# Altium schematic sheet USBc to Ethernet(2.0).SchDoc (part 3 of 3)
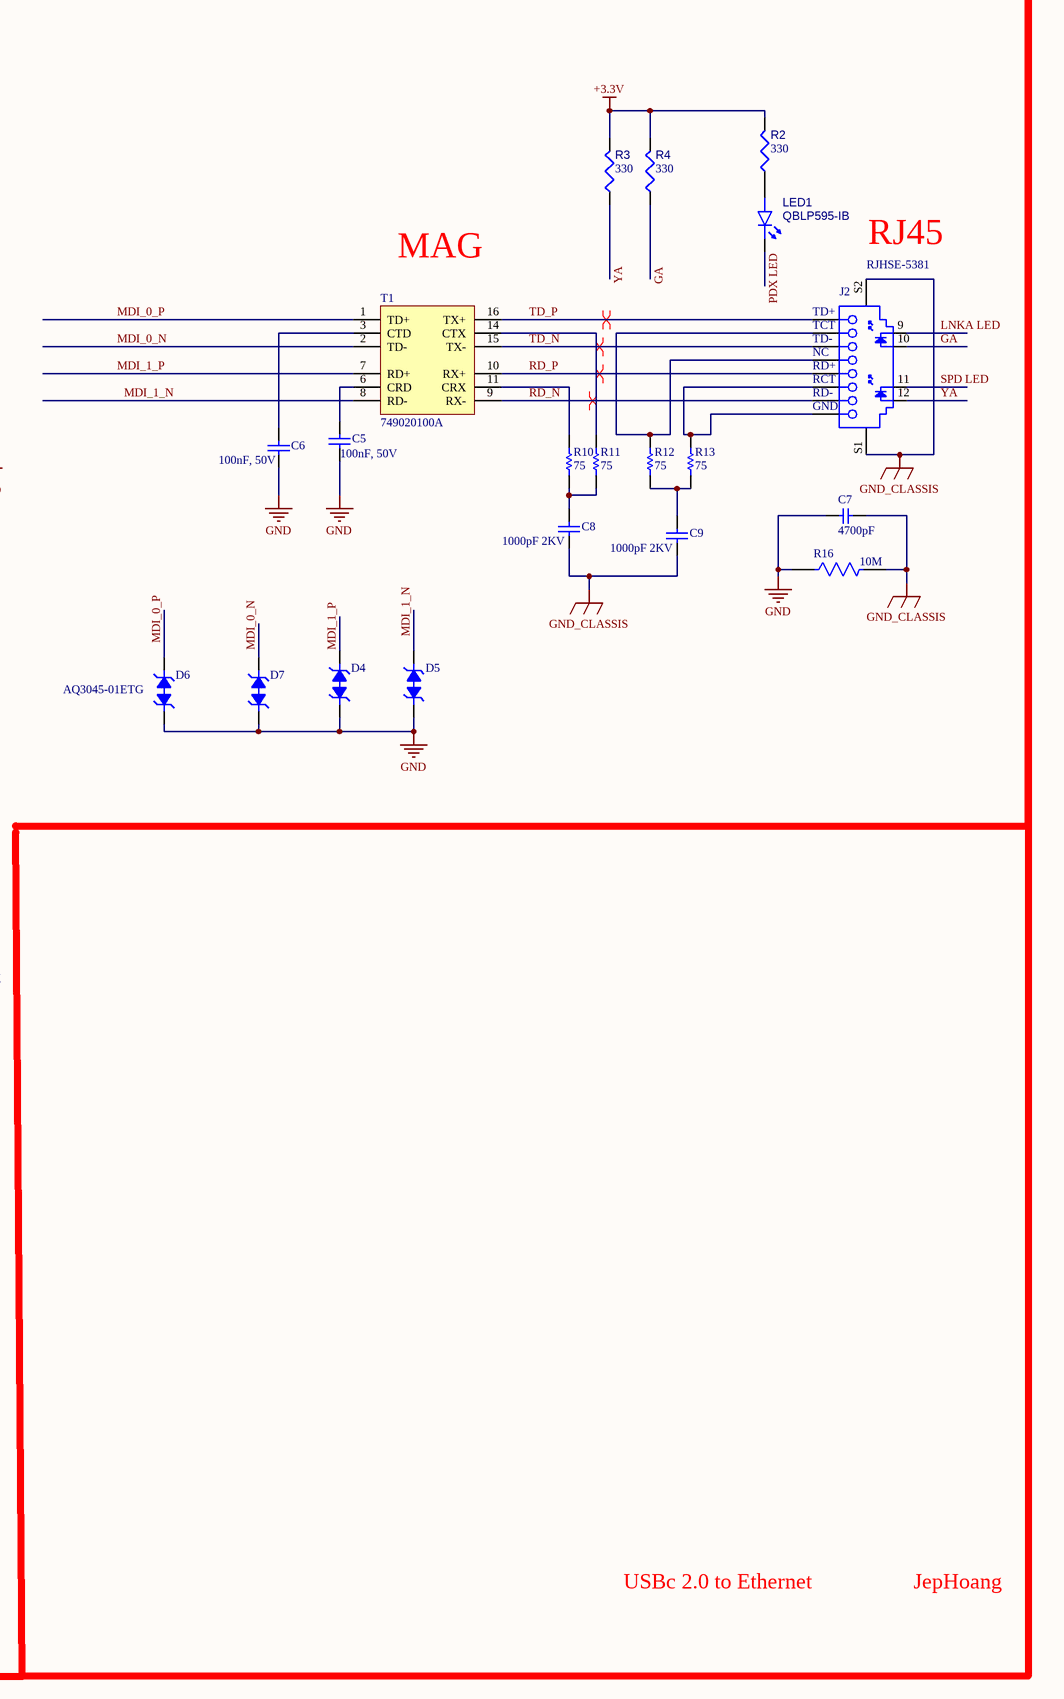
[diagram p3: USBc to Ethernet(2.0).SchDoc, right]

## Library data of the parts (continued)
R17 = RC0402FR-071KL: RES 1K OHM 1% 1/16W 0402; Manufacturer: Yageo; Additional Feature: LASER TRIMMABLE; Power: 62.5mW; Rated Temperature: 70°C; Value: 1kR; Temperature Coefficient: 100ppm/°C; Working Voltage: 50V; Package Height: 0.35mm; Package Length: 1mm; Package Width: 0.5mm; Supplier: Digikey; Supplier Part Number: 311-1.00KLRCT-ND; Manufacturer Part Number: RC0402FR-071KL; RoHS: Yes; Category: Chip SMD Resistors; Stock: 11967525; Pricing: 1=0.1, 10=0.015, 50=0.0088, 100=0.0073, 500=0.00488, 1000=0.00417, 5000=0.00297 (USD); Mounting Technology: Surface Mount; Pins: 2; Package Shape: Rectangular; Case/Package: 0402; Terminal Finish: Nickel; Min Operating Temperature: -55°C; Max Operating Temperature: 155°C; Tolerance: 1%; JESD-609 Code: e3; Resistor Type: FIXED RESISTOR; Construction: Chip; Package Style: SMTMeter; Packaging: Tape and Reel; Technology: METAL GLAZE/THICK FILM; Termination: Wraparound; Reach SVHC Compliant: Yes; RoHS Compliant: Yes; ComponentLink1URL: https://datasheet.ciiva.com:443/pdfs/VipMasterIC/IC/YAGO/YAGO-S-A0008145938/YAGO-S-A0008145938-1.pdf?src-supplier=IHS+Markit; ComponentLink1Description: https://datasheet.ciiva.com:443/pdfs/VipMasterIC/IC/YAGO/YAGO-S-A0008145938/YAGO-S-A0008145938-1.pdf?src-supplier=IHS+Markit; ComponentLink2URL: https://datasheet.ciiva.com/11819/0900766b80c66297-11819477.pdf?src-supplier=Rs; ComponentLink2Description: https://datasheet.ciiva.com/11819/0900766b80c66297-11819477.pdf?src-supplier=Rs; ComponentLink3URL: https://datasheet.ciiva.com/22747/1018594-22747513.pdf?src-supplier=Element14; ComponentLink3Description: https://datasheet.ciiva.com/22747/1018594-22747513.pdf?src-supplier=Element14; ComponentLink4URL: https://datasheet.ciiva.com/12666/pyu-rc0402-51-rohs-l-6-r-12666741.pdf?src-supplier=Mouser; ComponentLink4Description: https://datasheet.ciiva.com/12666/pyu-rc0402-51-rohs-l-6-r-12666741.pdf?src-supplier=Mouser; ComponentLink5URL: https://datasheet.ciiva.com/17063/pyu-rc0402-51-rohs-l-6-r-17063193.pdf?src-supplier=Future+Electronics; ComponentLink5Description: https://datasheet.ciiva.com/17063/pyu-rc0402-51-rohs-l-6-r-17063193.pdf?src-supplier=Future+Electronics; ComponentLink6URL: https://datasheet.ciiva.com/7983/1018594-7983502.pdf?src-supplier=Element14; ComponentLink6Description: https://datasheet.ciiva.com/7983/1018594-7983502.pdf?src-supplier=Element14; ComponentLink7URL: https://datasheet.ciiva.com/7849/1018594-7849869.pdf?src-supplier=Element14; ComponentLink7Description: https://datasheet.ciiva.com/7849/1018594-7849869.pdf?src-supplier=Element14; ComponentLink8URL: https://datasheet.ciiva.com/7849/1018594-7849871.pdf?src-supplier=Element14; ComponentLink8Description: https://datasheet.ciiva.com/7849/1018594-7849871.pdf?src-supplier=Element14; LCSC Part Number: C106235
R23 = CMP-03412-019294-1: RES SMD 1.5K OHM 0.5% 1/16W 0402; Manufacturer: Yageo; Manufacturer Part Number: RT0402DRD071K5L; Power Rating: 0.063W; Temperature Coefficient: 25 ppm/°C; Voltage Rating: 50V; Resistance: 1.5KΩ; Tolerance: 0.005; Value: 1.5KΩ; Height: 0.35mm; Octopart: https://octopart.com/rt0402drd071k5l-yageo-1260316; Temperature: -55°C to +155°C; Device Class L2: Resistors; Device Class L1: Passive Components; Temperature Range Low: -55°C; Mouser Description: Res Thin Film 0402 1.5K Ohm 0.5% 1/16W ±25ppm/°C Molded SMD Paper T/R; Category: Res; Temperature Range High: +155°C; Package: RT0402; Automotive: No; Digikey Description: RES SMD 1.5K OHM 0.5% 1/16W 0402; ComponentLink2URL: http://www.yageo.com/documents/recent/PYu-RT_1-to-0.01_RoHS_L_9.pdf; Series: RT; Device Class L3: Chip SMD Resistors; Lead Free: Yes; ComponentLink2Description: Datasheet; Ipc Land Pattern Name: RESC10050X30; Footprint Url: http://www.yageo.com/exep/pages/download/literatures/PYu-R_Mount_10.pdf; Composition: Thin Film; RoHS: TRUE
R27 = RC0402FR-073K01L: Res Thick Film 0402 3.01K Ohm 1% 1/16W ±100ppm/°C Molded SMD Paper T/R; Manufacturer: Yageo Group; Max Power Dissipation: 63mW; Power Rating: 62.5mW; Resistance: 3.01kΩ; Voltage Rating: 50V; Supplier 1: DigiKey; Manufacturer Part Number: RC0402FR-073K01L; RoHS: Compliant; Category: Chip SMD Resistors; Stock 1: 575918; Pricing 1: 1=0.1, 10=0.021, 25=0.0152, 50=0.012, 100=0.0097, 250=0.0074, 500=0.00612, 1000=0.00512, 5000=0.00355 (USD); Case/Package: 0402; Case Code (Imperial): 0402; China RoHS: Non-Compliant; Composition: Thick Film; Contact Plating: Tin; Country of Origin: Mainland China, Taiwan; Depth: 500µm; Export Control Classification Number (ECCN) Code: EAR99; Features: Moisture Resistant; Height: 350µm; Harmonized Tariff Schedule (HTS) Code: 8533.21.00.30; Introduction Date: 2004-10-04; Lead Free: Lead Free; Length: 1mm; Lifecycle Status: Production; Max Operating Temperature: 155°C; Military Standard: Not; Min Operating Temperature: -55°C; Mount: Surface Mount; Number of Terminals: 2; Number of Terminations: 2; REACH SVHC: Unaffected; Schedule B: 8533210045, 8533210045|8533210045|8533210045|8533210045|8533210045|8533210045|8533210045|8533210045|8533210045|8533210045|8533210045|8533210045|8533210045, 8533210045|8533210045|8533210045|8533210045|8533210045|8533210045|8533210045|8533210045|8533210045|8533210045|8533210045|8533210045|8533210045|8533210045, 8533210045|8533210045|8533210045|8533210045|8533210045|8533210045|8533210045|8533210045|8533210045|8533210045|8533210045|8533210045|8533210045|8533210045|8533210045; Temperature Coefficient: 100ppm/°C; Termination: SMD/SMT; Tolerance: 1%; Voltage Rating (DC): 50V; Width: 500µm; Working Voltage: 50V; ComponentLink1URL: https://datasheet.octopart.com:443/RC0402FR-073K01L-Yageo-datasheet-175887523.pdf?src-supplier=IHS; ComponentLink1Description: https://datasheet.octopart.com:443/RC0402FR-073K01L-Yageo-datasheet-175887523.pdf?src-supplier=IHS; ComponentLink2URL: https://datasheet.octopart.com:443/RC0402FR-073K01L-Yageo-datasheet-103092701.pdf?src-supplier=Upverter; ComponentLink2Description: https://datasheet.octopart.com:443/RC0402FR-073K01L-Yageo-datasheet-103092701.pdf?src-supplier=Upverter; ComponentLink3URL: https://datasheet.octopart.com:443/RC0402FR-073K01L-Yageo-Group-datasheet-190305687.pdf?src-supplier=Future+Electronics; ComponentLink3Description: https://datasheet.octopart.com:443/RC0402FR-073K01L-Yageo-Group-datasheet-190305687.pdf?src-supplier=Future+Electronics; ComponentLink4URL: https://datasheet.octopart.com:443/RC0402FR-073K01L-Yageo-datasheet-164759695.pdf?src-supplier=Future+Electronics; ComponentLink4Description: https://datasheet.octopart.com:443/RC0402FR-073K01L-Yageo-datasheet-164759695.pdf?src-supplier=Future+Electronics; ComponentLink5URL: https://datasheet.octopart.com:443/RC0402FR-073K01L-Yageo-datasheet-137700087.pdf?src-supplier=Future+Electronics; ComponentLink5Description: https://datasheet.octopart.com:443/RC0402FR-073K01L-Yageo-datasheet-137700087.pdf?src-supplier=Future+Electronics; ComponentLink6URL: https://datasheet.octopart.com:443/RC0402FR-073K01L-Yageo-datasheet-12531192.pdf?src-supplier=Future+Electronics; ComponentLink6Description: https://datasheet.octopart.com:443/RC0402FR-073K01L-Yageo-datasheet-12531192.pdf?src-supplier=Future+Electronics; ComponentLink7URL: https://datasheet.octopart.com:443/RC0402FR-073K01L-Yageo-datasheet-505231.pdf?src-supplier=Future+Electronics; ComponentLink7Description: https://datasheet.octopart.com:443/RC0402FR-073K01L-Yageo-datasheet-505231.pdf?src-supplier=Future+Electronics; ComponentLink8URL: https://datasheet.octopart.com:443/RC0402FR-073K01L-Yageo-datasheet-10408619.pdf?src-supplier=Newark; ComponentLink8Description: https://datasheet.octopart.com:443/RC0402FR-073K01L-Yageo-datasheet-10408619.pdf?src-supplier=Newark; ComponentLink9URL: https://datasheet.octopart.com:443/RC0402FR-073K01L-Yageo-datasheet-62067350.pdf?src-supplier=Newark; ComponentLink9Description: https://datasheet.octopart.com:443/RC0402FR-073K01L-Yageo-datasheet-62067350.pdf?src-supplier=Newark; ComponentLink10URL: https://datasheet.octopart.com:443/RC0402FR-073K01L-Yageo-Group-datasheet-176638170.pdf?src-supplier=TME; ComponentLink10Description: https://datasheet.octopart.com:443/RC0402FR-073K01L-Yageo-Group-datasheet-176638170.pdf?src-supplier=TME; ComponentLink11URL: https://datasheet.octopart.com:443/RC0402FR-073K01L-Yageo-Group-datasheet-189192902.pdf?src-supplier=TME; ComponentLink11Description: https://datasheet.octopart.com:443/RC0402FR-073K01L-Yageo-Group-datasheet-189192902.pdf?src-supplier=TME; ComponentLink12URL: https://datasheet.octopart.com/RC0402FR-073K01L-Yageo-datasheet-73766026.pdf; ComponentLink12Description: https://datasheet.octopart.com/RC0402FR-073K01L-Yageo-datasheet-73766026.pdf; ComponentLink13URL: http://sigma.octopart.com:80/conflict_mineral_statement/Yageo-company-3.pdf?src-supplier=Compliance+Statements; ComponentLink13Description: http://sigma.octopart.com:80/conflict_mineral_statement/Yageo-company-3.pdf?src-supplier=Compliance+Statements; ComponentLink14URL: http://sigma.octopart.com:80/rohs_statement/Yageo-company-2.pdf?src-supplier=Compliance+Statements; ComponentLink14Description: http://sigma.octopart.com:80/rohs_statement/Yageo-company-2.pdf?src-supplier=Compliance+Statements
T1 = CMP-03913-90391213-2: Xfmr, 10/100/1000 Base-T, 0.5 Port, Smd Rohs Compliant: Yes; Inductance: 350µH; Pitch: 1.27mm; Min Operating Temperature: -40°C; RoHS: Non-Compliant; Number of Pins: 12; Max Operating Temperature: 105°C; Width: 8.6mm; Height: 3.25mm
U1 = LAN9500AI-ABZJ-TR: Ethernet Bridge, USB to Ethernet USB 2.0, 10/100 Base-T/TX PHY USB Interface 56-QFN (8x8); Manufacturer: Microchip; Manufacturer Lifecycle Status: REL; Data Rate: 100Mbps; Interface: Ethernet, USB; Max Supply Voltage: 3.6V; Min Supply Voltage: 3V; Number of Channels: 1; Operating Supply Voltage: 3.3V; Supplier 1: DigiKey; Manufacturer Part Number: LAN9500AI-ABZJ-TR; RoHS: Compliant; Category: Ethernet Controller; Stock 1: 17687; Pricing 1: 1=6.57, 25=6.472 (USD); Projected EOL Date: 2039-03-03; Ambient Temperature Range High: 85°C; Contact Plating: Tin; Country of Assembly: Singapore, Taiwan; Country of Fabrication: Singapore; Country of Origin: Singapore, Taiwan; Export Control Classification Number (ECCN) Code: EAR99; Height: 1mm; HS Code: 8542.31.0030; Harmonized Tariff Schedule (HTS) Code: 8542.31.0030; Lead Free: Lead Free; Lifecycle Status: Production; Max Operating Temperature: 85°C; Min Operating Temperature: -40°C; Mount: Surface Mount; Number of Pins: 56; Radiation Hardening: No; Schedule B: 8542390000, 8542390000|8542390000|8542390000|8542390000|8542390000|8542390000|8542390000|8542390000|8542390000|8542390000|8542390000|8542390000|8542390000|8542390000|8542390000|8542390000|8542390000|8542390000|8542390000|8542390000|8542390000|8542390000|8542390000|85; ComponentLink1URL: https://datasheet.octopart.com:443/LAN9500AI-ABZJ-TR-Microchip-datasheet-101746277.pdf?src-supplier=Augswan; ComponentLink1Description: https://datasheet.octopart.com:443/LAN9500AI-ABZJ-TR-Microchip-datasheet-101746277.pdf?src-supplier=Augswan; ComponentLink2URL: https://datasheet.octopart.com:443/LAN9500AI-ABZJ-TR-Microchip-datasheet-179437561.pdf?src-supplier=Microchip; ComponentLink2Description: https://datasheet.octopart.com:443/LAN9500AI-ABZJ-TR-Microchip-datasheet-179437561.pdf?src-supplier=Microchip; ComponentLink3URL: https://datasheet.octopart.com:443/LAN9500AI-ABZJ-TR-Microchip-datasheet-140259316.pdf?src-supplier=Microchip; ComponentLink3Description: https://datasheet.octopart.com:443/LAN9500AI-ABZJ-TR-Microchip-datasheet-140259316.pdf?src-supplier=Microchip; ComponentLink4URL: https://datasheet.octopart.com:443/LAN9500AI-ABZJ-TR-Microchip-datasheet-166046754.pdf?src-supplier=Microchip; ComponentLink4Description: https://datasheet.octopart.com:443/LAN9500AI-ABZJ-TR-Microchip-datasheet-166046754.pdf?src-supplier=Microchip; ComponentLink5URL: https://datasheet.octopart.com:443/LAN9500AI-ABZJ-TR-Microchip-datasheet-154741932.pdf?src-supplier=Electro+Sonic; ComponentLink5Description: https://datasheet.octopart.com:443/LAN9500AI-ABZJ-TR-Microchip-datasheet-154741932.pdf?src-supplier=Electro+Sonic; ComponentLink6URL: https://datasheet.octopart.com:443/LAN9500AI-ABZJ-TR-Microchip-datasheet-57590167.pdf?src-supplier=Future+Electronics; ComponentLink6Description: https://datasheet.octopart.com:443/LAN9500AI-ABZJ-TR-Microchip-datasheet-57590167.pdf?src-supplier=Future+Electronics; ComponentLink7URL: http://sigma.octopart.com:80/188454377/materials_sheet/Microchip-LAN9500AI-ABZJ-TR.pdf?src-supplier=Compliance+Statements; ComponentLink7Description: http://sigma.octopart.com:80/188454377/materials_sheet/Microchip-LAN9500AI-ABZJ-TR.pdf?src-supplier=Compliance+Statements; ComponentLink8URL: http://sigma.octopart.com:80/rohs_statement/Microchip-company-71.pdf?src-supplier=Compliance+Statements; ComponentLink8Description: http://sigma.octopart.com:80/rohs_statement/Microchip-company-71.pdf?src-supplier=Compliance+Statements; ComponentLink9URL: http://sigma.octopart.com:80/reach_statement/Microchip-company-70.pdf?src-supplier=Compliance+Statements; ComponentLink9Description: http://sigma.octopart.com:80/reach_statement/Microchip-company-70.pdf?src-supplier=Compliance+Statements; ComponentLink10URL: http://sigma.octopart.com:80/conflict_mineral_statement/Microchip-company-69.pdf?src-supplier=Compliance+Statements; ComponentLink10Description: http://sigma.octopart.com:80/conflict_mineral_statement/Microchip-company-69.pdf?src-supplier=Compliance+Statements; ComponentLink11URL: http://sigma.octopart.com:80/conflict_mineral_statement/Microchip-company-68.pdf?src-supplier=Compliance+Statements; ComponentLink11Description: http://sigma.octopart.com:80/conflict_mineral_statement/Microchip-company-68.pdf?src-supplier=Compliance+Statements
U2 = TL1963A-33DCYR_1: IC REG LINEAR 3.3V 1.5A SOT223-4; Manufacturer: Texas Instruments; Package Body Material: Plastic; Adjustability: FIXED; Dropout Voltage1-Max: 550mV; Dropout Voltage1-Nom: 340mV; Input Voltage Absolute-Max: 20V; Min Input Voltage: 3.8V; Line Regulation-Max: 0.01%; Load Regulation-Max: 0.07%; Channels: 1; Output Voltage1-Max: 3.4V; Output Voltage1-Min: 3.2V; Regulator Type: FIXED POSITIVE SINGLE OUTPUT LDO REGULATOR; Voltage Tolerance-Max: 3%; Qualification Status: Not Qualified; Supplier: Digikey; Supplier Part Number: 296-24897-1-ND; Manufacturer Part Number: TL1963A-33DCYR; RoHS: Yes; Category: Voltage Regulators - Linear; Stock: 4105; Pricing: 1=2.91, 10=2.614, 25=2.4712, 100=2.1417, 250=2.03188, 500=1.8232, 1000=1.53764 (USD); Case/Package: SOP; Pins: 4; Package Shape: Rectangular; Terminal Finish: Tin; JESD-609 Code: e3; Max Supply Voltage: 20V; JESD-30 Code: R-PDSO-G4; Moisture Sensitivity Level: 2; Number of Outputs: 1; Operating Temperature, TJ-Max: 125°C; Operating Temperature, TJ-Min: -40°C; Output Current1-Max: 1.5A; Output Voltage1-Nom: 3.3V; Package Style: SMALL OUTLINEMeter; Packaging: Tape and Reel; Peak Reflow Temperature (Cel): 260°C; Surface Mount: Yes; Technology: BIPOLAR; Terminal Form: Gull Wing; Terminal Position: DUAL; Length: 6.5mm; Width: 3.5mm; Height - Seated (Max): 1.8mm; Terminal Pitch: 2.3mm; Reach SVHC Compliant: Yes; RoHS Compliant: Yes; ComponentLink1URL: https://www.ti.com:443/lit/ds/symlink/tl1963a.pdf?src-supplier=IHS+Markit; ComponentLink1Description: https://www.ti.com:443/lit/ds/symlink/tl1963a.pdf?src-supplier=IHS+Markit; ComponentLink2URL: https://datasheet.ciiva.com/2046/-2046068.pdf?src-supplier=Digikey; ComponentLink2Description: https://datasheet.ciiva.com/2046/-2046068.pdf?src-supplier=Digikey; LCSC Part Number: C181262
U3 = CMP-09095-000001-1: INDUSTRIAL ETHERNET GIGABIT PHY; Manufacturer: Analog Devices; Nominal Supply Current: 20-31mA; Data Rate: 100Mbits/s; Standoff Height: 0.02mm; Max Junction Temp: +125°C; Min Supply Voltage: 1.71V; Simplex Duplex: Full Duplex; Max Supply Voltage: 3.46V; Number Of Channels: 4; ComponentLink2URL: https://www.analog.com/media/en/technical-documentation/data-sheets/ADIN1200.pdf; Height: 0.8mm; Automotive: No; RoHS: TRUE; Digikey Description: INDUSTRIAL ETHERNET GIGABIT PHY; Package: CP-32-31; Octopart: https://octopart.com/adin1200ccp32z-analog+devices-103760365; Device Class L3: Ethernet Interface ICs; Interface: Ethernet; Temperature: -40°C to +105°C; Category: IC; Lead Free: Yes; Device Class L2: Interface ICs; Ipc Land Pattern Name: QFN50P500X500X75-32; Ambient Temperature Range High: +105°C; Manufacturer Part Number: ADIN1200CCP32Z; Device Class L1: Integrated Circuits (ICs); ComponentLink2Description: Datasheet; Footprint Url: https://forum.upverter.com/uploads/short-url/dN8iC8CK9Ps5z8gUJcfltSaVrDQ.pdf; Temperature Range High: +105°C; Ambient Temperature Range Low: -40°C; Temperature Range Low: -40°C
Y1 Y2 = 445I23A25M00000: Parallel - Fundamental Quartz Crystal, 25MHz Nom; Manufacturer: CTS Components; ESR (Equivalent Series Resistance): 40Ω; Frequency Stability: 30ppm; Frequency Tolerance: 0.002%; Load Capacitance: 10pF; Supplier 1: DigiKey; Manufacturer Part Number: 445I23A25M00000; RoHS: Compliant; Category: Crystals; Pricing 1: 6000=0.4851 (USD); Case/Package: SMD/SMT; Contact Plating: Gold; Country of Origin: Mainland China; Frequency: 25MHz; Height: 1.3462mm; Harmonized Tariff Schedule (HTS) Code: 8541.60.00.60; Introduction Date: 2016-10-07; Length: 5.0038mm; Lifecycle Status: Production; Max Operating Temperature: 85°C; Min Operating Temperature: -40°C; Mount: Surface Mount; Packaging: Tape & Reel; REACH SVHC: Unaffected; Series Resistance: 40Ω; Termination: SMD/SMT; Tolerance: 0.002%; Width: 3.2mm; ComponentLink1URL: https://datasheet.octopart.com:443/445I23A25M00000-CTS-Components-datasheet-78374999.pdf?src-supplier=Electro+Sonic; ComponentLink1Description: https://datasheet.octopart.com:443/445I23A25M00000-CTS-Components-datasheet-78374999.pdf?src-supplier=Electro+Sonic